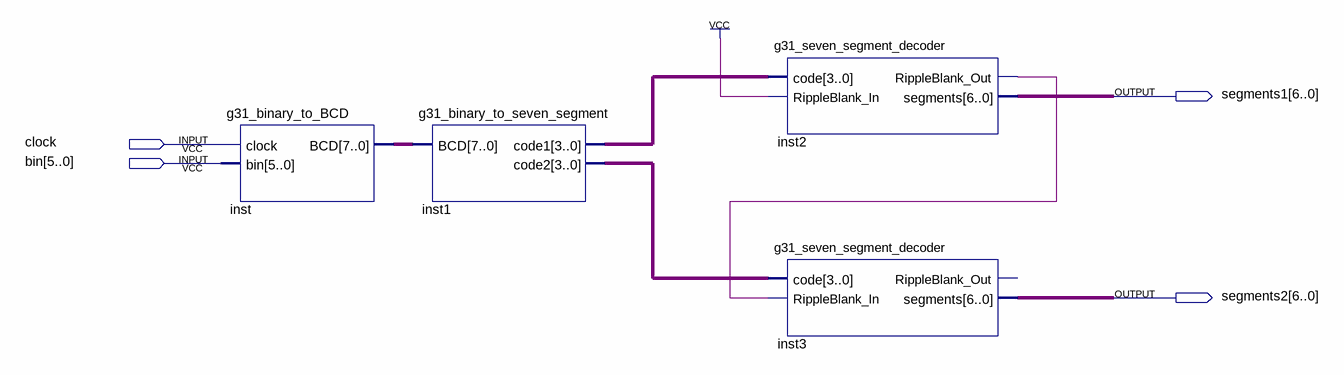
[diagram p0: schematic sheet]
// Quartus schematic g31_binary_to_seven_segment_circuit.bdf as structural Verilog: 4 symbols, 4 pins
module g31_binary_to_seven_segment_circuit (
  input  clock,
  input  [5:0] bin,
  output [6:0] segments1,
  output [6:0] segments2
);

  wire inst2_rippleblank_out;
  wire [3:0] inst1_code1, inst1_code2;
  wire [7:0] inst_bcd;

  g31_binary_to_BCD inst (.clock(clock), .bin(bin), .BCD(inst_bcd));
  g31_binary_to_seven_segment inst1 (.BCD(inst_bcd), .code1(inst1_code1), .code2(inst1_code2));
  g31_seven_segment_decoder inst2 (
    .code(inst1_code1), .RippleBlank_In(1'b1), .RippleBlank_Out(inst2_rippleblank_out), .segments(segments1));
  g31_seven_segment_decoder inst3 (
    .code(inst1_code2), .RippleBlank_In(inst2_rippleblank_out), .segments(segments2));  // open: RippleBlank_Out
endmodule
